# EAGLE design TFT-Board (EAGLE 7.5.0)
TFT adaptor board simple adaptor from microMaTch 10 to Ledsee 2.2" TFT. Status: Placement final Routing finished
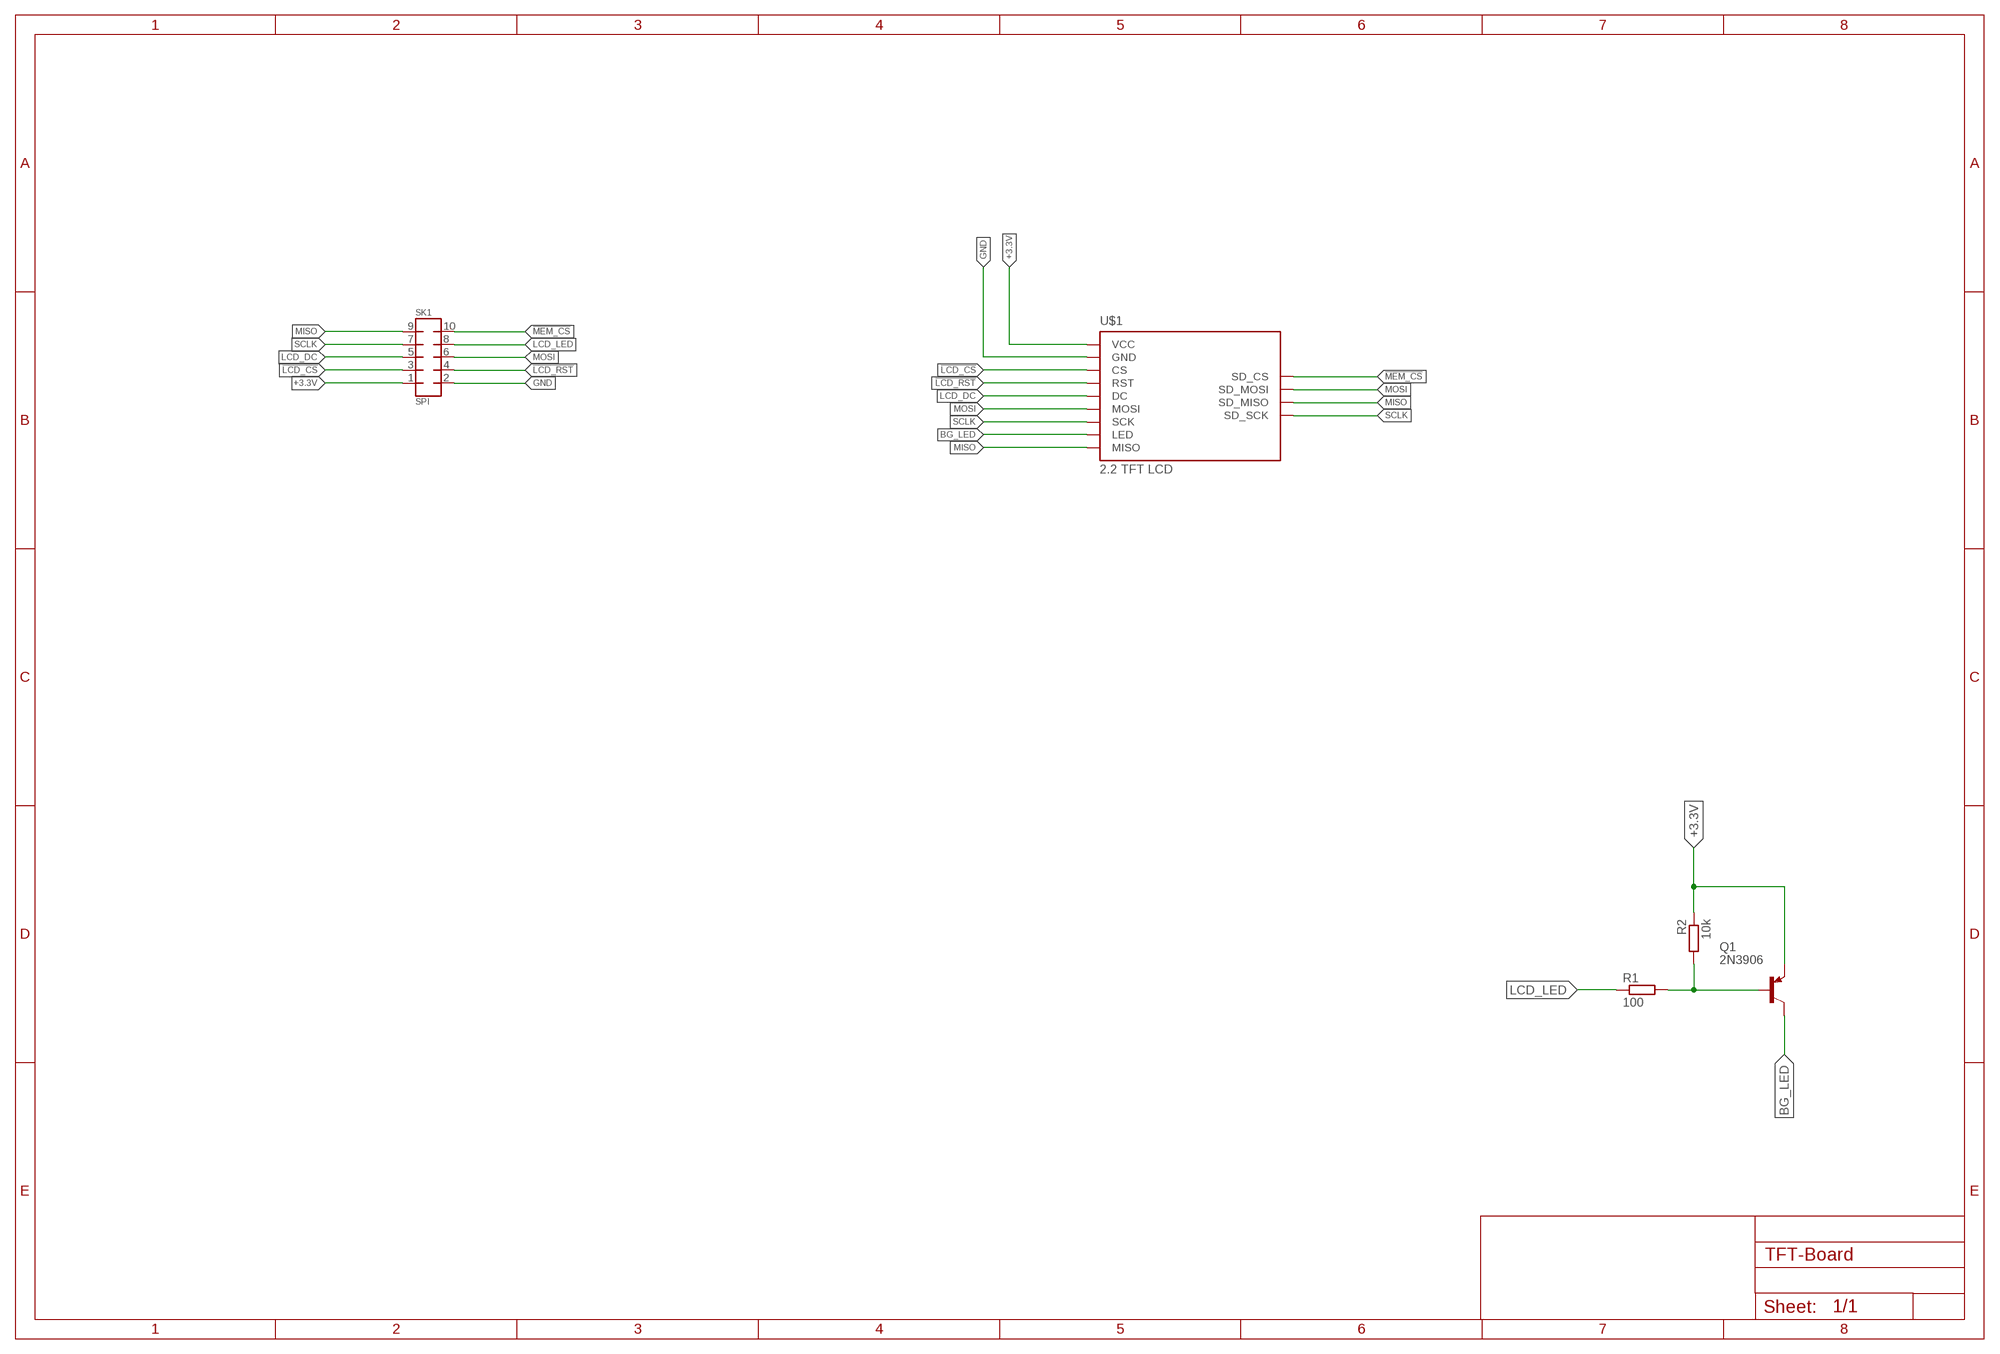
[diagram p0: schematic, sheet 1]

## Parts
Q1  2N3906  [TO92]
R1  100  R-EU_0204/7  [0204/7]
R2  10k  R-EU_0204/7  [0204/7]
SK1  SPI  MMATCH-10-PTH  [AMP-215079-10]
U$1  2.2_TFT_LCDNEW  [2.2_TFT_LCD_LEDSEE]

## Nets
!LCD_CS: SK1.3 U$1.P$3_CS(CS)
!LCD_RST: SK1.4 U$1.P$2_RESET(RST)
!MEM_CS: SK1.10 U$1.P$2_SD_CS(SD_CS)
+3.3V [SUPPLY]: Q1.3(E) R2.1 SK1.1 U$1.P$5_VCC(VCC)
BG_LED: Q1.1(C) U$1.P$8_LED(LED)
GND [SUPPLY]: SK1.2 U$1.P$4_GND(GND)
LCD_DC: SK1.5 U$1.P$1_DC(DC)
LCD_LED: R1.1 SK1.8
MISO: SK1.9 U$1.P$3_SD_MISO(SD_MISO) U$1.P$9_MISO(MISO)
MOSI: SK1.6 U$1.P$1_SD_MOSI(SD_MOSI) U$1.P$6_MOSI(MOSI)
N$1: Q1.2(B) R1.2 R2.2
SCLK: SK1.7 U$1.P$4_SD_SCK(SD_SCK) U$1.P$7_SCK(SCK)

## Library data of the parts
Q1 = transistor-pnp:2N3906: PNP Transistor
R1 R2 = resistor:R-EU_: RESISTOR, European symbol
SK1 = jt-con-micromatch:MMATCH-10-*: AMP Micromatch 10-pin
U$1 = 2.2"tft:2.2_TFT_LCD

## Net classes
0 default: width 0.203 mm
1 SUPPLY: width 0.406 mm

## Board
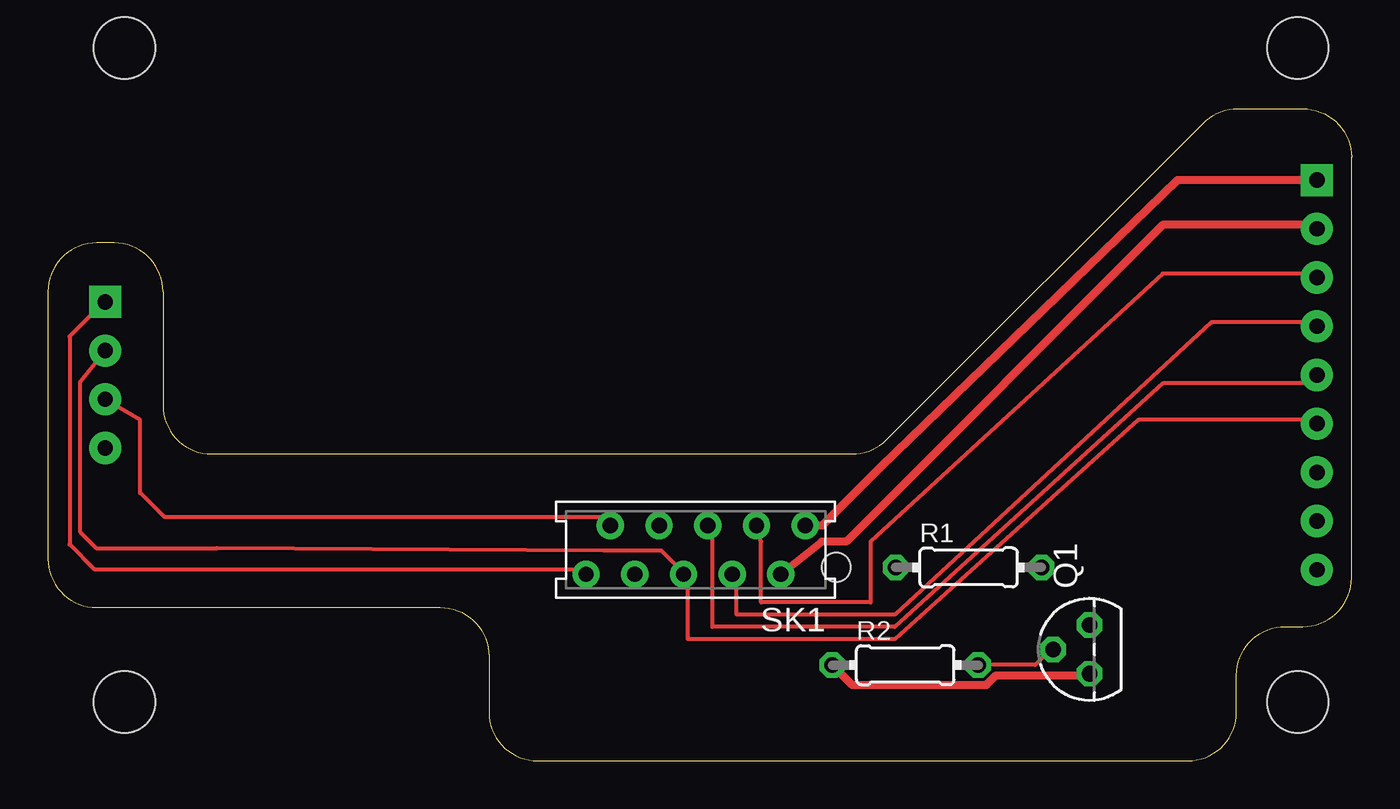
[diagram p1: board, top side]
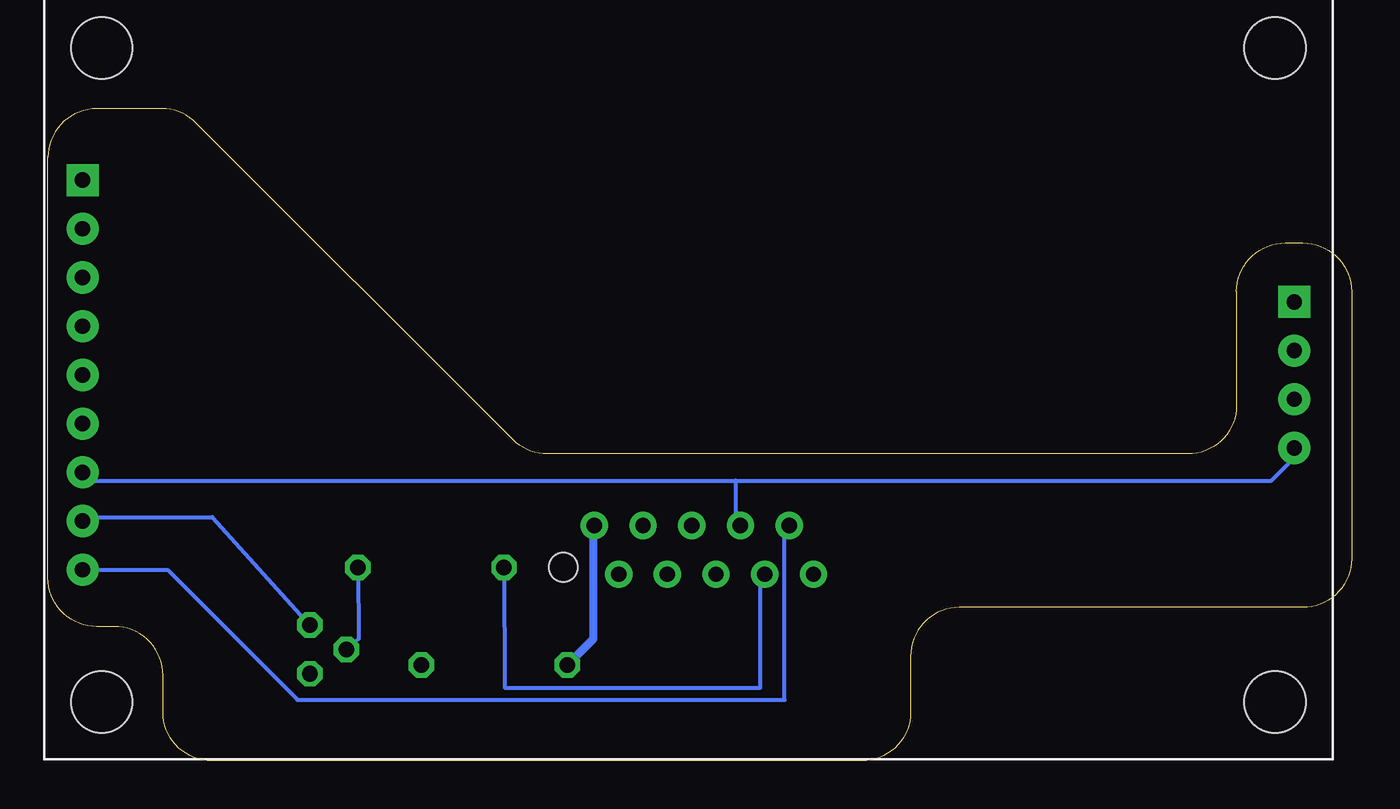
[diagram p2: board, bottom side, seen from below]

Size 68 x 34 mm. Coordinates in mm from the lower left corner, seen from the top.
Outline: 6,24.46 6,18.54 arc90 8.54,16 41.95,16 arc45 43.74,16.74 60.26,33.26 arc-45 62.05,34 65.46,34 arc-90 68,31.46 68,9.54 arc-90 65.46,7 64.54,7 arc90 62,4.46 62,2.54 arc-90 59.46,0 25.54,0 arc-90 23,2.54 23,5.46 arc90 20.46,8 2.54,8 arc-90 0,10.54 0,24.46 arc-90 2.54,27 3.46,27 arc-90 6,24.46
Copper layers (1*16): Top 0.035mm / dielectric 1.5mm / Bottom 0.035mm
Design rules "dirt_cheap_dirty_boards.v1": minimum track width 5mil, minimum drill 12mil, track to track 5mil, track to pad 5mil, pad to pad 5mil, via to via 5mil, smd to smd 0mil, copper to edge 10mil, drill to drill 10mil, minimum pad ring 10mil, minimum via ring 6mil, stop-mask expansion 2mil, vias tented up to drill 25mil, thermal gap 10mil

### Footprints (pad centres in the part's own frame; a part is rotated, then mirrored left to right if it is on the bottom)
TO92 = drill 0.813 octagon: 1 1.27,0; 2 0,1.905; 3 -1.27,0
0204/7 = drill 0.813 octagon: 1 -3.81,0; 2 3.81,0
AMP-215079-10 = drill 0.8 pad 1.422: 1 0,-1.27; 2 1.27,1.27; 3 2.54,-1.27; 4 3.81,1.27; 5 5.08,-1.27; 6 6.35,1.27; 7 7.62,-1.27; 8 8.89,1.27; 9 10.16,-1.27; 10 11.43,1.27 | hole 1.5: -1.62,0.905
2.2_TFT_LCD_LEDSEE = drill 0.8 pad 1.676: P$1_DC -31.6,0; P$1_SD_MOSI 31.6,1.27; P$2_RESET -31.6,2.54; P$3_CS -31.6,5.08; P$3_SD_MISO 31.6,-1.27; P$4_GND -31.6,7.62; P$4_SD_SCK 31.6,-3.81; P$6_MOSI -31.6,-2.54; P$7_SCK -31.6,-5.08; P$8_LED -31.6,-7.62; P$9_MISO -31.6,-10.16 | drill 0.8 pad 1.676 square: P$2_SD_CS 31.6,3.81; P$5_VCC -31.6,10.16 | hole 3.2: -30.6,17.05; 30.6,17.05; 30.6,-17.05; -30.6,-17.05

### Placement (x,y rotation side)
Q1  54.34,5.81 90 top
R1  48.02,10.08 0 top
R2  44.72,4.99 0 top
SK1  39.5,11 180 top
U$1  34.59,20.12 0 bottom

### Tracks (layer width: path | path; a pad name or v marks a point on that pad's centre or on a via)
!LCD_CS
  Top 0.203: U$1.P$3_CS 65.77,25.4 58.15,25.4 42.91,11.43 42.91,8.26 37.2,8.26 37.2,11.43 SK1.3
!LCD_RST
  Top 0.203: U$1.P$2_RESET 65.77,22.86 60.69,22.86 44.18,7.62 35.92,7.62 35.92,9.53 SK1.4
!MEM_CS
  Top 0.203: SK1.10 28,10 2.42,10 1.14,11.29 1.14,22.14 2.5,23.5 U$1.P$2_SD_CS
+3.3V
  Top 0.406: Q1.3 54.33,4.46 49.46,4.46 48.96,3.96 41.95,3.96 40.95,4.95 R2.1 | U$1.P$5_VCC 58.91,30.28 43.41,15.27 40.41,12.27 SK1.1
  Bottom 0.406: SK1.1 39.55,12.22 39.55,6.36 40.87,5.04 R2.1 | 54.41,4.54 Q1.3
BG_LED
  Bottom 0.203: U$1.P$8_LED 65.77,12.7 59.42,12.7 Q1.1
GND
  Top 0.406: U$1.P$4_GND 65.77,27.94 58.15,27.94 41.64,11.43 40.37,11.43 SK1.2
LCD_DC
  Top 0.203: U$1.P$1_DC 65.77,19.68 58.15,19.68 44.18,6.99 34.66,6.99 34.66,12.06 SK1.5
LCD_LED
  Bottom 0.203: R1.1 44.18,3.81 30.84,3.81 30.84,9.53 SK1.8
MISO
  Top 0.203: SK1.9 28.94,12.7 6.08,12.7 4.81,13.97 4.81,17.78 U$1.P$3_SD_MISO
  Bottom 0.203: U$1.P$9_MISO 61.76,9.96 54.98,3.17 29.57,3.17 29.57,12.06 SK1.9
MOSI
  Top 0.203: U$1.P$1_SD_MOSI 1.69,19.77 1.69,11.92 2.51,11.1 8.82,11.1 29,10.96 32,10.96 33,9.96 33,10 SK1.6 33.38,9.53 33.38,6.35 44.18,6.35 56.88,17.78 65.77,17.78 U$1.P$6_MOSI
N$1
  Top 0.203: R2.2 49,5 51.5,5 52,5.5 Q1.2
  Bottom 0.203: 48.5,5 R2.2 | R1.2 51.8,6.35 Q1.2
SCLK
  Bottom 0.203: U$1.P$7_SCK 65.75,14.61 32.11,14.61 | 32.11,14.61 4.17,14.61 2.99,15.79 U$1.P$4_SD_SCK | SK1.7 32.11,12.51 32.11,14.61